# EAGLE design USB_servo (EAGLE 4.16)
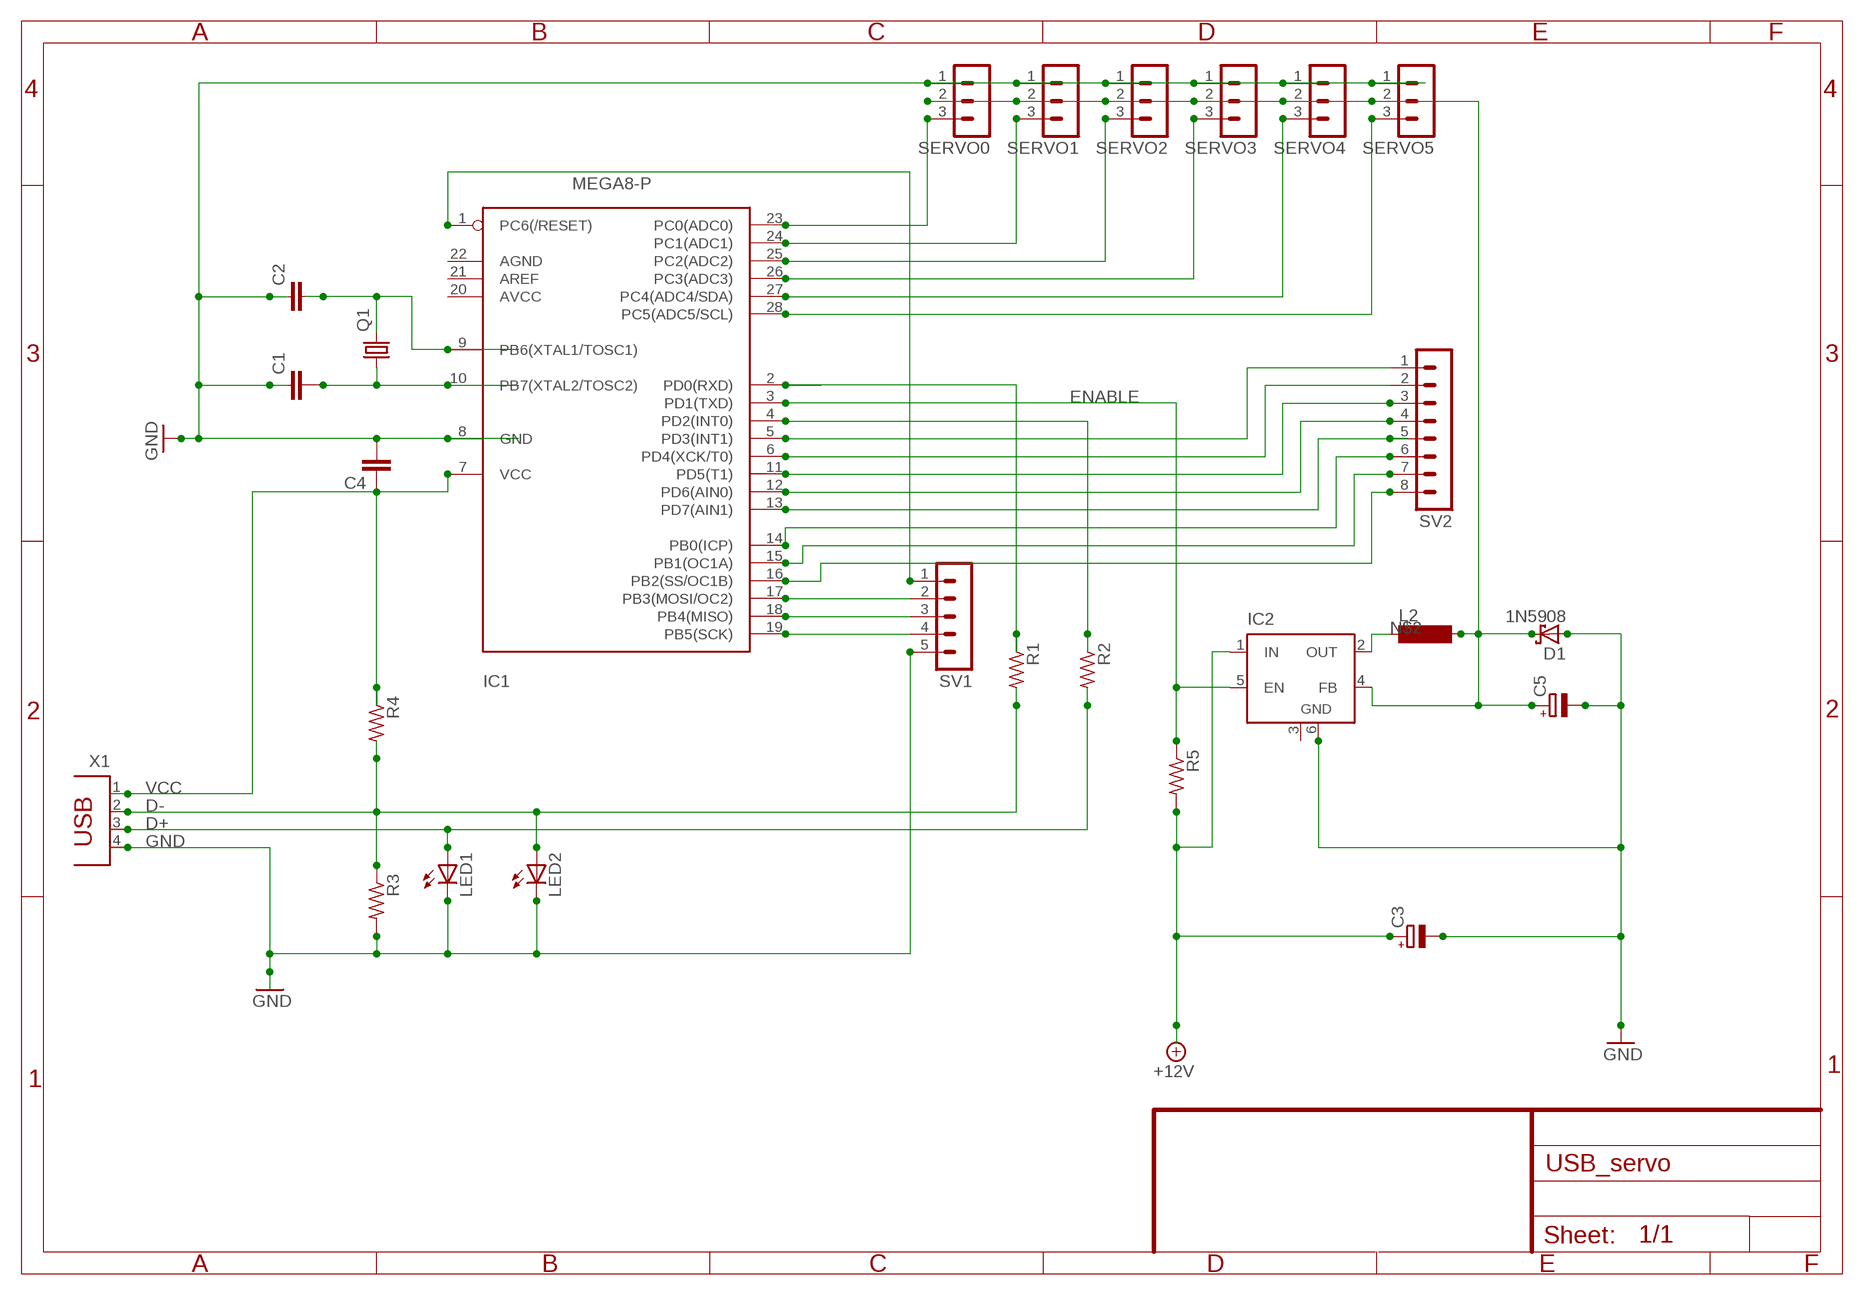
[diagram p0: schematic, sheet 1]

## Parts
C1  C2,5-3  [C2.5-3]
C2  C2,5-3  [C2.5-3]
C3  CPOL-EUE5-10.5  [E5-10,5]
C4  C2,5-3  [C2.5-3]
C5  CPOL-EUE5-10.5  [E5-10,5]
D1  1N5908  [C4111-15]
IC1  MEGA8-P  [DIL28-3]
IC2  LM2596S  [TO263-5]
L2  MS85  [MS85]
LED1  LED5MM  [LED5MM]
LED2  LED5MM  [LED5MM]
Q1  CRYSTALHC49U-V  [HC49U-V]
R1  R-US_0309/12  [0309/12]
R2  R-US_0309/12  [0309/12]
R3  R-US_0309/12  [0309/12]
R4  R-US_0309/12  [0309/12]
R5  R-US_0309/12  [0309/12]
SERVO0  MA03-1  [MA03-1]
SERVO1  MA03-1  [MA03-1]
SERVO2  MA03-1  [MA03-1]
SERVO3  MA03-1  [MA03-1]
SERVO4  MA03-1  [MA03-1]
SERVO5  MA03-1  [MA03-1]
SV1  MA05-1  [MA05-1]
SV2  MA08-1  [MA08-1]
X1  PN61729  [PN61729]

## Nets
+12V: C3.+ IC2.1(IN) R5.2
D+: LED1.A R2.2 X1.3
D-: LED2.A R1.2 R3.1 R4.2 X1.2
ENABLE: IC1.3(PD1(TXD)) IC2.5(EN) R5.1
GND: C1.1 C2.1 C3.- C4.2 C5.- D1.A IC1.8(GND) IC2.6(GND) LED1.K(C) LED2.K(C) R3.2 SERVO0.1 SERVO1.1 SERVO2.1 SERVO3.1 SERVO4.1 SERVO5.1 SV1.5 X1.4
N$1: C1.2 IC1.10(PB7(XTAL2/TOSC2)) Q1.1
N$2: C5.+ D1.C IC2.4(FB) L2.2 SERVO0.2 SERVO1.2 SERVO2.2 SERVO3.2 SERVO4.2 SERVO5.2
N$3: IC1.1(PC6(/RESET)) SV1.1
N$6: IC1.2(PD0(RXD)) R1.1
N$7: IC1.4(PD2(INT0)) R2.1
N$8: IC1.17(PB3(MOSI/OC2)) SV1.2
N$10: IC1.23(PC0(ADC0)) SERVO0.3
N$11: IC1.24(PC1(ADC1)) SERVO1.3
N$12: IC1.25(PC2(ADC2)) SERVO2.3
N$13: IC1.26(PC3(ADC3)) SERVO3.3
N$14: IC1.27(PC4(ADC4/SDA)) SERVO4.3
N$15: IC1.28(PC5(ADC5/SCL)) SERVO5.3
N$17: IC1.18(PB4(MISO)) SV1.3
N$18: C2.2 IC1.9(PB6(XTAL1/TOSC1)) Q1.2
N$19: IC2.2(OUT) L2.1
N$20: IC1.19(PB5(SCK)) SV1.4
N$21: IC1.5(PD3(INT1)) SV2.1
N$22: IC1.6(PD4(XCK/T0)) SV2.2
N$23: IC1.11(PD5(T1)) SV2.3
N$24: IC1.12(PD6(AIN0)) SV2.4
N$25: IC1.13(PD7(AIN1)) SV2.5
N$26: IC1.14(PB0(ICP)) SV2.6
N$27: IC1.15(PB1(OC1A)) SV2.7
N$28: IC1.16(PB2(SS/OC1B)) SV2.8
VCC: C4.1 IC1.7(VCC) R4.1 X1.1
Unconnected: IC1.20(AVCC) IC1.21(AREF) IC1.22(AGND)

## Power pins joined to a net without a drawn wire
GND: IC2.3(GND)

## Library data of the parts
C1 C2 C4 = capacitor-wima:C: CAPACITOR naming: grid - package width
C3 C5 = rcl:CPOL-EU: POLARIZED CAPACITOR, European symbol
D1 = diode:1N5908: DIODE schottky
IC1 = atmel:MEGA8-P: MICROCONTROLLER 8 Kbytes FLASH 1 kbytes SRAM 512 bytes EEPROM USART 4-channel 10 bit ADC 2-channel 8 bit ADC Source: avr.lbr
IC2 = linear:LM2596S: STEP-DOWN VOLTAGE REGULATOR
L2 = inductor-neosid:MS85: INDUCTOR SMD power inductor
LED1 LED2 = led:LED: LED OSRAM: - CHIPLED LG R971, LG N971, LY N971, LG Q971, LY Q971, LO R971, LY R971 LH N974, LH R974 LS Q976, LO Q976, LY Q976 LO Q996 - Hyper CHIPLED LW Q18S LB Q993, LB Q99A, LB R99A - SideLED LS A670, LO A670, LY A670, LG A670, LP A670 LB A673, LV A673, LT A673, LW A673 LH A674 LY A675 LS A676, LA A676, LO A676, LY A676, LW A676 LS A679, LY A679, LG A679 - Hyper Micro SIDELED® LS Y876, LA Y876, LO Y876, LY Y876 LT Y87S - SmartLED LW L88C, LW L88S LB L89C, LB L89S, LG L890 LS L89K, LO L89K, LY L89K LS L896, LA L896, LO L896, LY L896 - TOPLED LS T670, LO T670, LY T670, LG T670, LP T670 LSG T670, LSP T670, LSY T670, LOP T670, LYG T670 LG T671, LOG T671, LSG T671 LB T673, LV T673, LT T673, LW T673 LH T674 LS T676, LA T676, LO T676, LY T676, LB T676, LH T676, LSB T676, LW T676 LB T67C, LV T67C, LT T67C, LS T67K, LO T67K, LY T67K, LW E67C LS E67B, LA E67B, LO E67B, LY E67B, LB E67C, LV E67C, LT E67C LW T67C LS T679, LY T679, LG T679 LS T770, LO T770, LY T770, LG T770, LP T770 LB T773, LV T773, LT T773, LW T773 LH T774 LS E675, LA E675, LY E675, LS T675 LS T776, LA T776, LO T776, LY T776, LB T776 LHGB T686 LT T68C, LB T68C - Hyper Mini TOPLED® LB M676 - Mini TOPLED Santana® LG M470 LS M47K, LO M47K, LY M47K Source: http://www.osram.convergy.de - LUMILED® LXK2-PW12-R00, LXK2-PW12-S00, LXK2-PW14-U00, LXK2-PW14-V00 LXK2-PM12-R00, LXK2-PM12-S00, LXK2-PM14-U00 LXK2-PE12-Q00, LXK2-PE12-R00, LXK2-PE12-S00, LXK2-PE14-T00, LXK2-PE14-U00 LXK2-PB12-K00, LXK2-PB12-L00, LXK2-PB12-M00, LXK2-PB14-N00, LXK2-PB14-P00, LXK2-PB14-Q00 LXK2-PR12-L00, LXK2-PR12-M00, LXK2-PR14-Q00, LXK2-PR14-R00 LXK2-PD12-Q00, LXK2-PD12-R00, LXK2-PD12-S00 LXK2-PH12-R00, LXK2-PH12-S00 LXK2-PL12-P00, LXK2-PL12-Q00, LXK2-PL12-R00 Source: www.luxeon.com
Q1 = crystal:CRYSTAL: CRYSTAL
R1-R5 = rcl:R-US_: RESISTOR, American symbol
SERVO0 SERVO1-SERVO5 = con-lstb:MA03-1: PIN HEADER
SV1 = con-lstb:MA05-1: PIN HEADER
SV2 = con-lstb:MA08-1: PIN HEADER
X1 = con-berg:PN61729: BERG USB connector

## Board
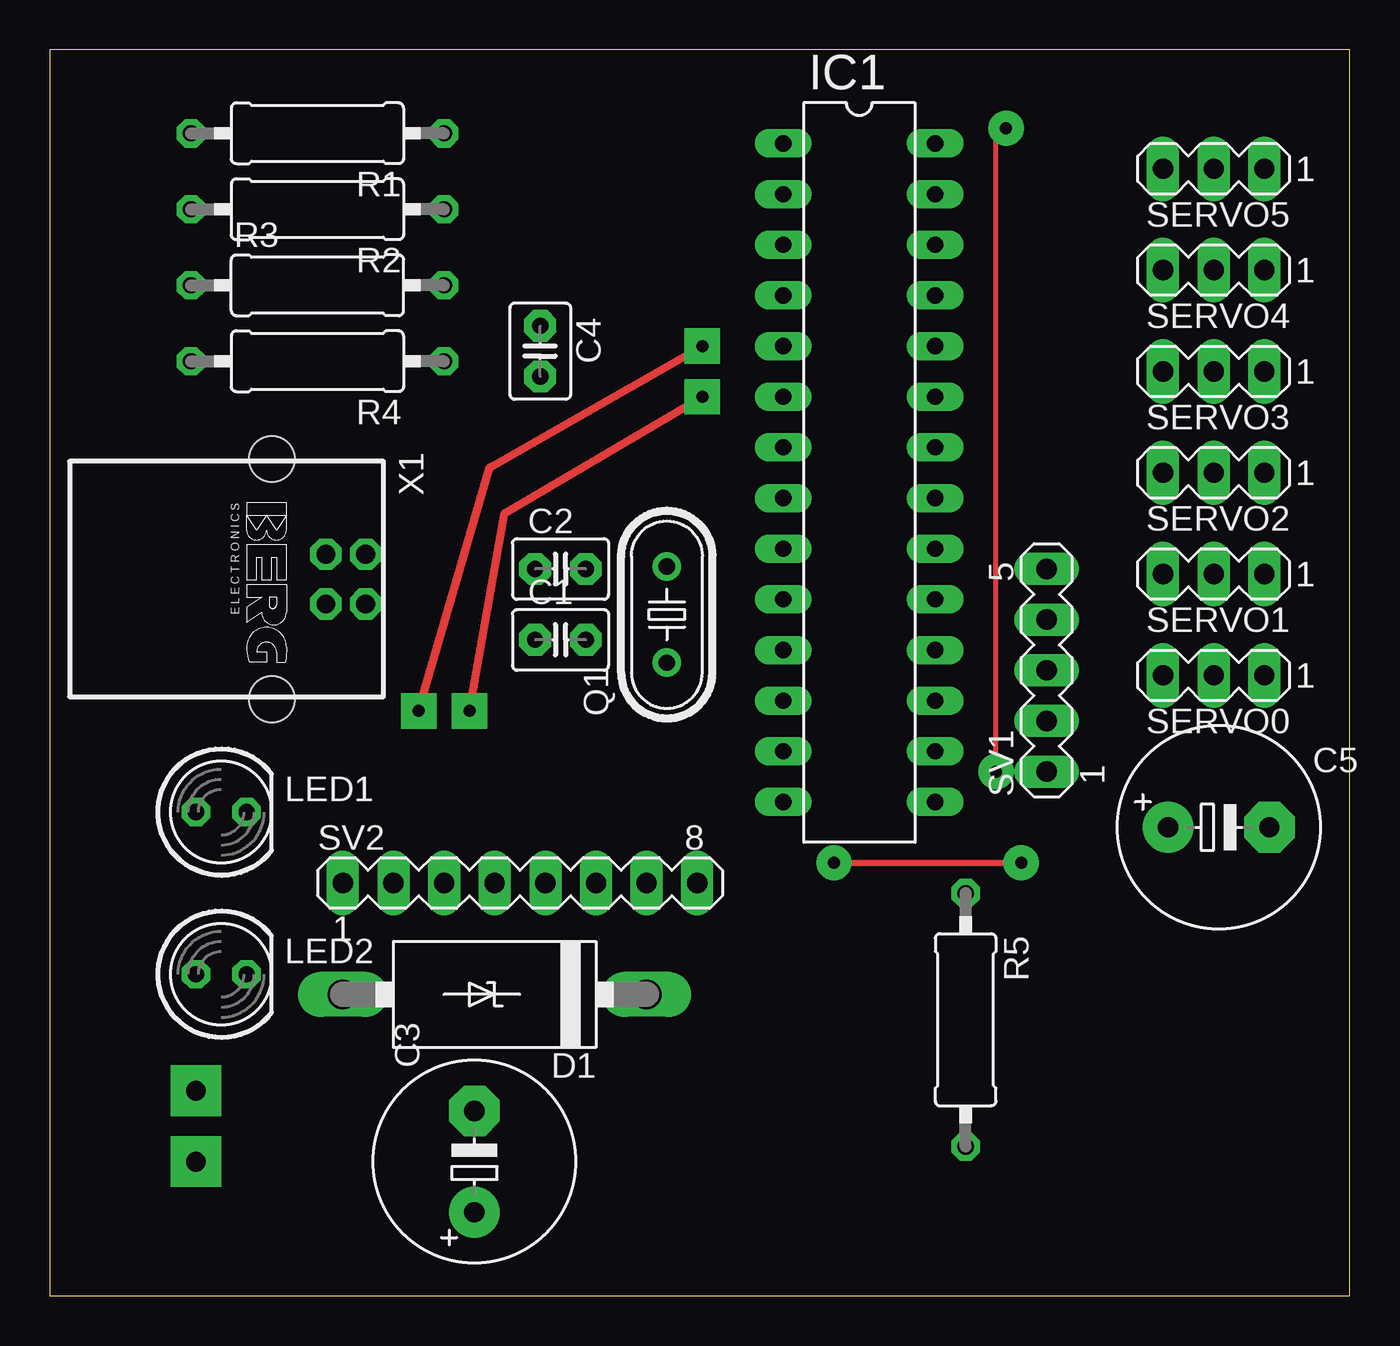
[diagram p1: board, top side]
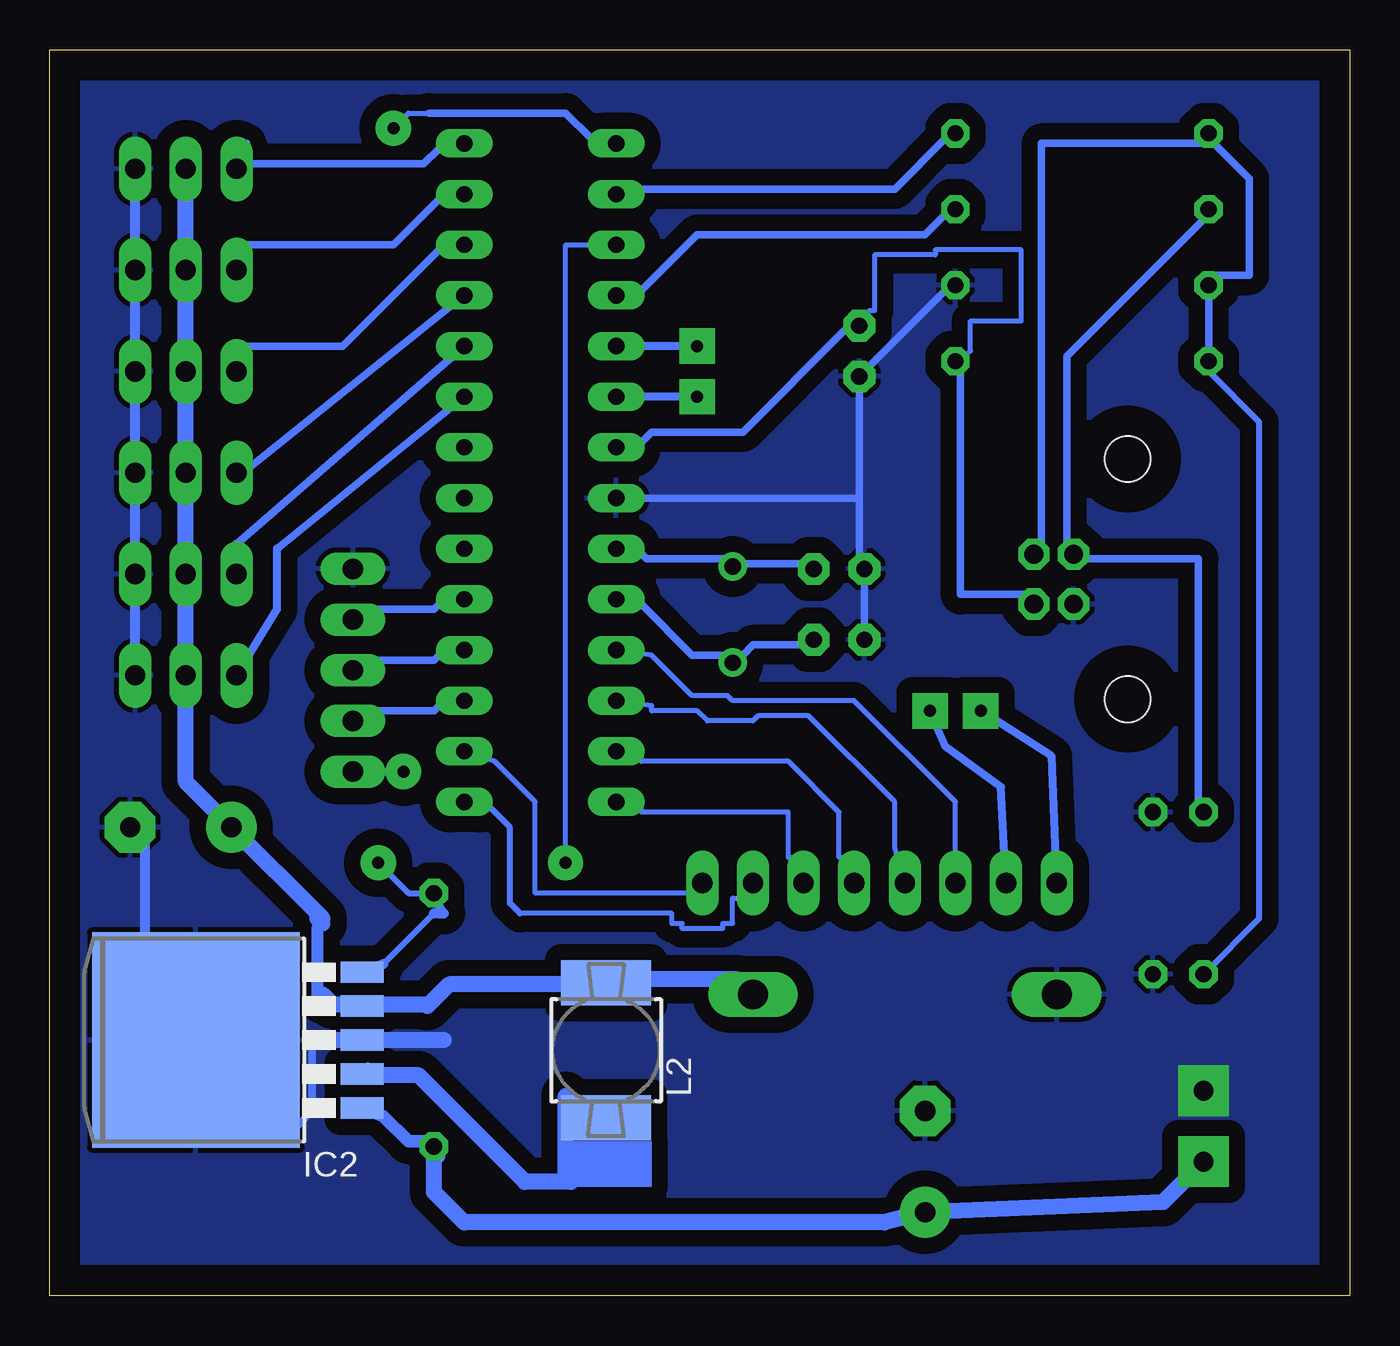
[diagram p2: board, bottom side, seen from below]

Size 65.2 x 62.47 mm. Coordinates in mm from the lower left corner, seen from the top.
Outline: 0,0 65.2,0 65.2,62.47 0,62.47 0,0
Copper layers (1*16): Top 0.035mm / dielectric 1.5mm / Bottom 0.035mm
Design rules "mypcb": minimum track width 10mil, minimum drill 44mil, track to track 20mil, track to pad 20mil, pad to pad 10mil, via to via 20mil, smd to smd 12mil, copper to edge 60mil, drill to drill 8mil, minimum pad ring 12mil, minimum via ring 8mil, stop-mask expansion 4mil, vias tented up to drill 0mil, thermal gap 10mil

### Footprints (pad centres in the part's own frame; a part is rotated, then mirrored left to right if it is on the bottom)
C2.5-3 = drill 0.813 pad 1.6 octagon: 1 -1.27,0; 2 1.27,0
E5-10,5 = drill 1.016 pad 2.54 round: + -2.54,0 | drill 1.016 pad 2.54 octagon: - 2.54,0
C4111-15 = drill 1.499 long: A 7.62,0; C -7.62,0
DIL28-3 = drill 0.813 long: 1 -16.51,-3.81; 2 -13.97,-3.81; 3 -11.43,-3.81; 4 -8.89,-3.81; 5 -6.35,-3.81; 6 -3.81,-3.81; 7 -1.27,-3.81; 8 1.27,-3.81; 9 3.81,-3.81; 10 6.35,-3.81; 11 8.89,-3.81; 12 11.43,-3.81; 13 13.97,-3.81; 14 16.51,-3.81; 15 16.51,3.81; 16 13.97,3.81; 17 11.43,3.81; 18 8.89,3.81; 19 6.35,3.81; 20 3.81,3.81; 21 1.27,3.81; 22 -1.27,3.81; 23 -3.81,3.81; 24 -6.35,3.81; 25 -8.89,3.81; 26 -11.43,3.81; 27 -13.97,3.81; 28 -16.51,3.81
TO263-5 = smd 1.067 x 2.159: 1 -3.404,-5.791; 2 -1.702,-5.791; 3 0,-5.791; 4 1.702,-5.791; 5 3.404,-5.791 | smd 10.8 x 10.41: 6 0,2.54
MS85 = smd 4.5 x 2.25: 1 0,-3.383; 2 0,3.383
LED5MM = drill 0.813 octagon: A -1.27,0; K 1.27,0
HC49U-V = drill 0.813 round: 1 -2.413,0; 2 2.413,0
0309/12 = drill 0.813 octagon: 1 -6.35,0; 2 6.35,0
MA03-1 = drill 1.016 long: 1 -2.54,0; 2 0,0; 3 2.54,0
MA05-1 = drill 1.016 long: 1 -5.08,0; 2 -2.54,0; 3 0,0; 4 2.54,0; 5 5.08,0
MA08-1 = drill 1.016 long: 1 -8.89,0; 2 -6.35,0; 3 -3.81,0; 4 -1.27,0; 5 1.27,0; 6 3.81,0; 7 6.35,0; 8 8.89,0
PN61729 = drill 0.95 octagon: 1 1.25,4.71; 2 -1.25,4.71; 3 -1.25,2.71; 4 1.25,2.71 | hole 2.3: -6.02,0; 6.02,0

### Placement (x,y rotation side)
C1  25.62,32.89 0 top
C2  25.62,36.44 0 top
C3  21.3,6.73 90 top
C4  24.6,47.37 270 top
C5  58.64,23.49 0 top
D1  22.31,15.11 180 top
IC1  40.6,41.27 270 top
IC2  55.33,12.82 90 bottom
L2  37.3,12.31 0 bottom
LED1  8.6,24.25 0 top
LED2  8.6,16.12 0 top
Q1  30.95,34.16 90 top
R1  13.42,58.29 180 top
R2  13.42,54.48 180 top
R3  13.42,50.67 0 top
R4  13.42,46.86 180 top
R5  45.94,13.84 270 top
SERVO0  58.38,31.11 180 top
SERVO1  58.38,36.19 180 top
SERVO2  58.38,41.27 180 top
SERVO3  58.38,46.35 180 top
SERVO4  58.38,51.43 180 top
SERVO5  58.38,56.51 180 top
SV1  50,31.36 90 top
SV2  23.58,20.7 0 top
X1  11.14,35.94 270 top

### Tracks (layer width: path | path; a pad name or v marks a point on that pad's centre or on a via)
+12V  (via drill 1 pad 2.54)
  Bottom 0.635: 45.68,6.98 R5.2 46.44,7.74 47.21,7.74 48.48,9.01 IC2.1
  Bottom 0.813: v7.33,6.73 9.36,4.69 C3.+ 23.33,3.68 44.41,3.68 45.94,5.2 R5.2
D+
  Bottom 0.381: R2.2 7.33,53.97 14.19,47.11 14.19,37.71 X1.3 13.17,36.95 7.58,36.95 7.58,24.76 LED1.A
D-
  Bottom 0.305: LED2.A 4.53,18.92 4.53,43.81 7.07,46.35 R4.2
  Bottom 0.381: R4.2 R3.1 6.82,51.18 5.04,51.18 5.04,56 6.82,57.78 R1.2 7.33,57.78 15.46,57.78 15.46,37.71 X1.2
ENABLE  (via drill 0.6 pad 1.78)
  Top 0.305: v39.33,21.71 v48.73,21.71
  Bottom 0.254: R5.1 45.38,19.2 | v39.33,21.71 39.33,52.7 IC1.3
  Bottom 0.305: v48.73,21.71 47.21,20.19 R5.1 | 48.78,16.52 48.73,16.46 48.73,16.38 45.94,19.17 | 45.38,19.2 45.94,19.75 R5.1 | R5.1 45.68,19.93 45.68,19.17
  Bottom 0.508: 45.94,19.17 45.68,19.17 45.43,19.17 | IC2.5 48.78,16.52 48.48,16.63
GND  (via drill 1 pad 2.54)
  Bottom 0.381: 52.03,12.82 52.03,9.27 52.79,8.5 IC2.6 | C1.1 C2.1 24.6,37.21 24.6,40 | R3.2 20.28,50.41 C4.2 24.6,40 | 24.6,40 IC1.8
  Bottom 0.508: SERVO5.1 SERVO4.1 SERVO3.1 SERVO2.1 SERVO1.1 SERVO0.1 60.67,29.84 | 60.41,23.49 60.41,18.16 IC2.6
  Bottom 0.813: 45.43,12.82 IC2.3 52.03,12.82
  other vias: 7.33,10.28
  pour Bottom (isolate 0.813): -4.1,62.1 -4.1,4.19 -3.09,0.88 69.3,0.88 71.84,5.71 71.84,60.83 69.05,63.62 -0.55,63.62 -1.05,63.11
N$1
  Bottom 0.381: C1.2 27.65,32.63 29.93,32.63 30.44,32.13 Q1.1 31.46,32.13 32.98,32.13 35.52,34.67 IC1.10
N$2
  Bottom 0.508: SERVO0.2 58.13,29.84
  Bottom 0.61: 51.52,15.11 51.78,15.11 51.78,18.41 51.52,18.66
  Bottom 0.813: D1.C 30.7,15.87 37.3,15.87 L2.2 37.13,15.7 37.05,15.62 45.17,15.62 46.27,14.52 46.34,14.6 49.47,14.6 | 51.65,19.04 51.52,18.92 | 51.65,19.04 C5.+ 58.38,25.78 SERVO0.2 SERVO1.2 SERVO2.2 SERVO3.2 SERVO4.2 SERVO5.2 | 49.49,14.58 49.49,14.6 50.25,14.6 | 50.25,14.6 51.02,14.6 51.4,14.98 | 51.65,19.04 51.78,18.92 51.52,18.66 | 51.4,14.98 51.52,15.11 | 51.4,14.98 51.52,14.85 | 49.47,14.6 IC2.4 | 49.47,14.6 50.25,14.6
N$3  (via drill 0.6 pad 1.78)
  Top 0.254: v47.46,26.28 47.46,58.03 v47.97,58.54
  Bottom 0.254: v47.97,58.54 47.21,59.3 46.19,59.3
  Bottom 0.381: 46.19,59.3 39.33,59.3 38.06,58.03 IC1.1 | v47.46,26.28 SV1.1
N$6
  Bottom 0.381: R1.1 20.28,58.03 22.82,55.49 35.52,55.49 IC1.2
N$7
  Bottom 0.381: IC1.4 35.52,50.41 32.73,53.21 21.3,53.21 20.28,54.22 R2.1
N$8
  Bottom 0.381: IC1.17 45.68,29.59 45.94,29.33 48.73,29.33 SV1.2
N$10
  Bottom 0.406: IC1.23 53.81,37.46 53.81,34.41 SERVO0.3
N$11
  Bottom 0.406: IC1.24 55.84,37.71 SERVO1.3 55.84,35.94
N$12
  Bottom 0.406: SERVO2.3 55.84,41.02 IC1.25
N$13
  Bottom 0.381: IC1.26 45.68,52.45 50.51,47.62 55.33,47.62 SERVO3.3
N$14
  Bottom 0.381: IC1.27 45.68,54.99 47.97,52.7 55.33,52.7 SERVO4.3
N$15
  Bottom 0.381: 55.33,57.78 SERVO5.3 55.33,56.76 46.44,56.76 45.68,57.53 IC1.28
N$17
  Bottom 0.381: IC1.18 45.68,32.13 45.94,31.87 48.73,31.87 SV1.3
N$18
  Bottom 0.381: C2.2 27.65,36.7 30.44,36.7 Q1.2 31.46,36.95 35.27,36.95 35.52,37.21 IC1.9
N$19
  Bottom 0.508: 39.33,10.03 L2.1
  Bottom 0.813: 39.33,10.03 39.33,5.96 39.08,5.71 41.36,5.71 46.7,11.04 48.98,11.04 49.24,11.3 49.42,11.12 IC2.2
N$20
  Bottom 0.381: IC1.19 45.68,34.67 45.94,34.41 48.73,34.41 SV1.4
N$21  (via drill 0.6 pad 1.78)
  Top 0.406: v32.73,47.62 22.06,41.52 v18.5,29.33
  Bottom 0.406: v32.73,47.62 IC1.5 | v18.5,29.33 14.95,27.05 SV2.1
N$22  (via drill 0.6 pad 1.78)
  Top 0.406: v32.73,45.08 22.82,39.24 v21.04,29.33
  Bottom 0.406: v32.73,45.08 IC1.6 | v21.04,29.33 20.28,27.55 17.49,25.52 SV2.2
N$23
  Bottom 0.254: IC1.11 35.01,32.13 32.98,30.09 31.2,30.09 30.95,29.84 24.85,29.84 19.77,24.76 SV2.3
N$24
  Bottom 0.254: IC1.12 35.01,29.59 35.01,29.33 32.73,29.33 32.22,28.82 29.93,28.82 29.68,29.08 27.14,29.08 22.82,24.76 22.82,22.47 SV2.4
N$25
  Bottom 0.254: IC1.13 35.52,27.05 35.52,26.79 28.16,26.79 25.62,24.25 25.62,21.97 25.36,21.97 SV2.5
N$26
  Bottom 0.254: IC1.14 35.52,24.51 35.52,24.25 28.16,24.25 28.16,21.97 27.9,21.97 SV2.6
N$27
  Bottom 0.254: 43.65,24.25 IC1.15 43.4,24.25 | 41.62,19.17 34,19.17 34,18.66 33.49,18.66 33.49,18.41 31.46,18.41 31.46,18.66 30.95,18.66 30.95,19.93 30.7,19.93 SV2.7
  Bottom 0.305: 41.62,19.17 42.13,19.68 42.13,23.49 43.4,24.76 IC1.15
N$28
  Bottom 0.254: IC1.16 42.89,26.79 40.86,24.76 40.86,20.19 33.24,20.19 SV2.8
VCC
  Bottom 0.254: R4.1 19.01,47.37 19.01,48.89 16.47,48.89 16.47,52.45 20.79,52.45 20.79,52.19 23.84,52.19 23.84,49.4 24.09,49.4 C4.1
  Bottom 0.381: R4.1 19.52,46.35 19.52,35.17 16.22,35.17 X1.1 | IC1.7 35.52,42.79 35.01,43.3 30.44,43.3 25.36,48.38 C4.1
(copper drawn outside any net)
  shapes: Bottom area x1